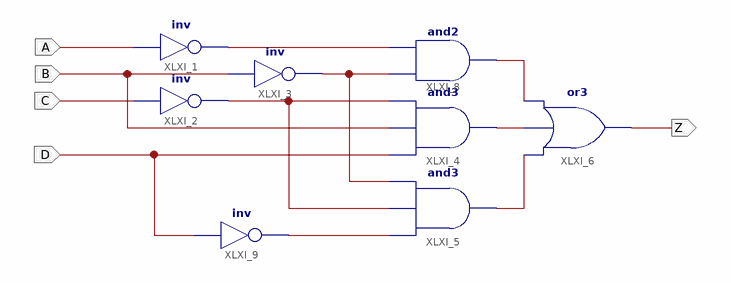
[diagram p0: schematic sheet 1]
// Xilinx ISE schematic p1ej2a.sch (spartan3) as structural Verilog: 8 symbols, 5 ports
module p1ej2a (
  input  A,
  input  C,
  input  B,
  input  D,
  output Z
);

  wire XLXN_13, XLXN_19, XLXN_20, XLXN_21, XLXN_23, XLXN_25, XLXN_28;

  not XLXI_1 (XLXN_23, A);
  not XLXI_2 (XLXN_13, C);
  not XLXI_3 (XLXN_25, B);
  and XLXI_4 (XLXN_21, D, B, XLXN_13);
  or XLXI_6 (Z, XLXN_20, XLXN_21, XLXN_19);
  and XLXI_8 (XLXN_19, XLXN_25, XLXN_23);
  and XLXI_5 (XLXN_20, XLXN_28, XLXN_13, XLXN_25);
  not XLXI_9 (XLXN_28, D);
endmodule
